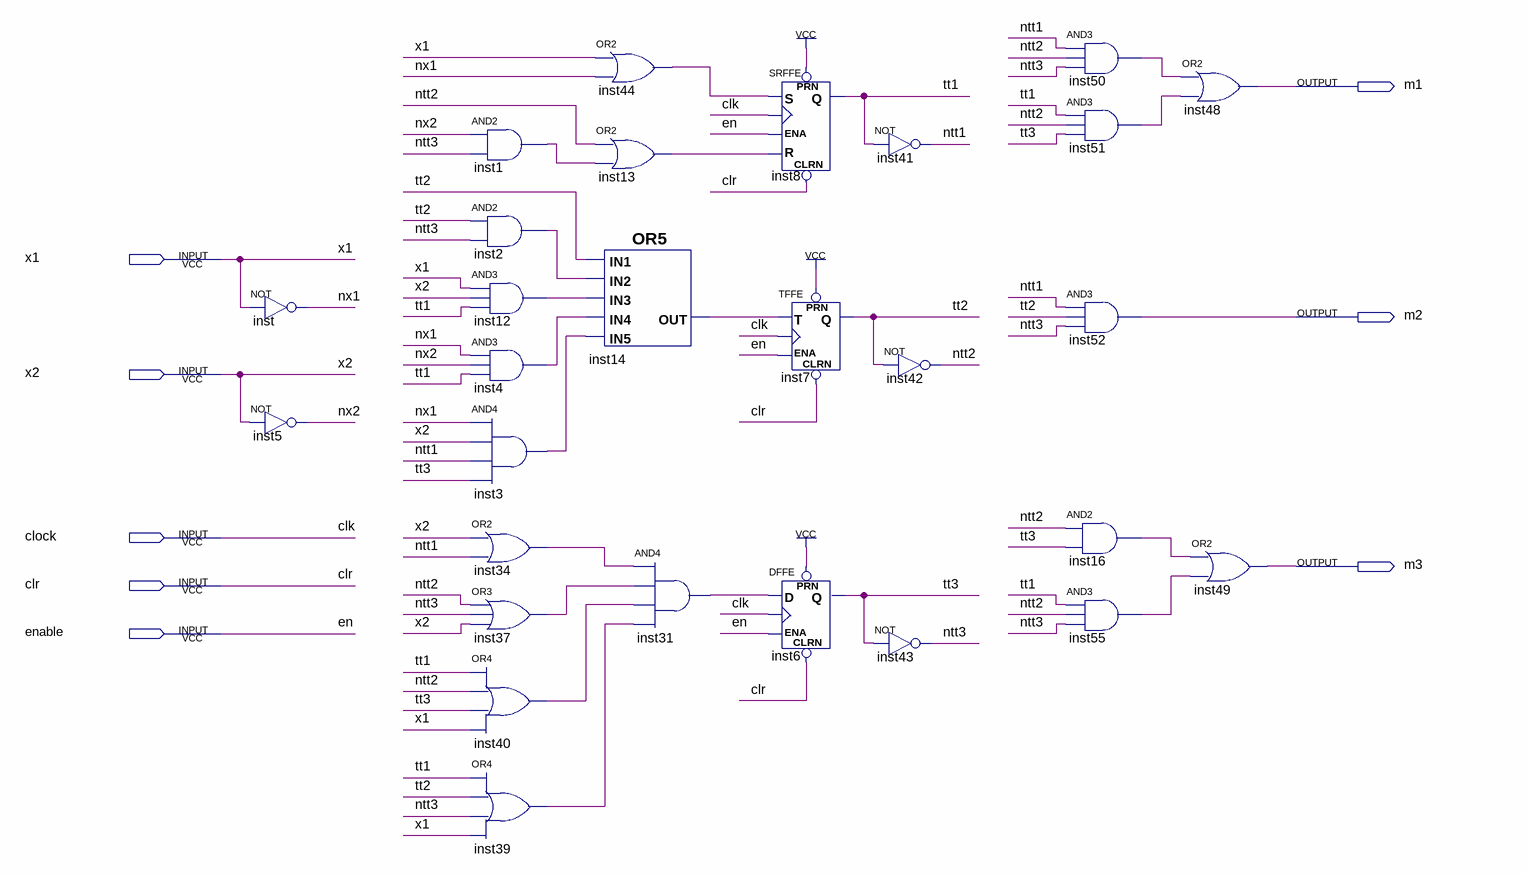
[diagram p0: schematic sheet]
// Quartus schematic struct_mura.bdf as structural Verilog: 28 symbols, 8 pins
module struct_mura (
  input  x1,
  input  x2,
  input  clock,
  input  clr,
  input  enable,
  output m1,
  output m2,
  output m3
);

  wire inst1_out, inst2_out, inst3_out, inst4_out, inst12_out, inst13_out, inst14_out, inst16_out,
       inst31_out, inst34_out, inst37_out, inst39_out, inst40_out, inst44_out, inst50_out, inst51_out,
       inst55_out, ntt1, ntt2, ntt3, nx1, nx2, tt1, tt2, tt3;

  not inst (nx1, x1);
  not inst5 (nx2, x2);
  and inst1 (inst1_out, nx2, ntt3);
  and inst2 (inst2_out, tt2, ntt3);
  and inst12 (inst12_out, x1, x2, tt1);
  and inst4 (inst4_out, nx1, nx2, tt1);
  and inst3 (inst3_out, nx1, x2, ntt1, tt3);
  or inst34 (inst34_out, x2, ntt1);
  or inst37 (inst37_out, ntt2, ntt3, x2);
  or inst40 (inst40_out, tt1, ntt2, tt3, x1);
  or inst39 (inst39_out, tt1, tt2, ntt3, x1);
  or inst44 (inst44_out, x1, nx1);
  or inst13 (inst13_out, ntt2, inst1_out);
  or inst14 (inst14_out, tt2, inst2_out, inst12_out, inst4_out, inst3_out);
  and inst31 (inst31_out, inst34_out, inst37_out, inst40_out, inst39_out);
  SRFFE inst8 (.PRN(1'b1), .S(inst44_out), .CLK(clock), .CLRN(clr), .R(inst13_out), .ENA(enable), .Q(tt1));
  TFFE inst7 (.CLRN(clr), .T(inst14_out), .CLK(clock), .ENA(enable), .PRN(1'b1), .Q(tt2));
  DFFE inst6 (.PRN(1'b1), .CLRN(clr), .D(inst31_out), .CLK(clock), .ENA(enable), .Q(tt3));
  not inst41 (ntt1, tt1);
  not inst42 (ntt2, tt2);
  not inst43 (ntt3, tt3);
  and inst50 (inst50_out, ntt1, ntt2, ntt3);
  and inst51 (inst51_out, tt1, ntt2, tt3);
  and inst52 (m2, ntt1, tt2, ntt3);
  and inst16 (inst16_out, ntt2, tt3);
  and inst55 (inst55_out, tt1, ntt2, ntt3);
  or inst48 (m1, inst50_out, inst51_out);
  or inst49 (m3, inst16_out, inst55_out);

  // Other names for the same wires on the sheet: clk = clock; en = enable
endmodule
